# Altium schematic sheet filter.SchDoc
size A4
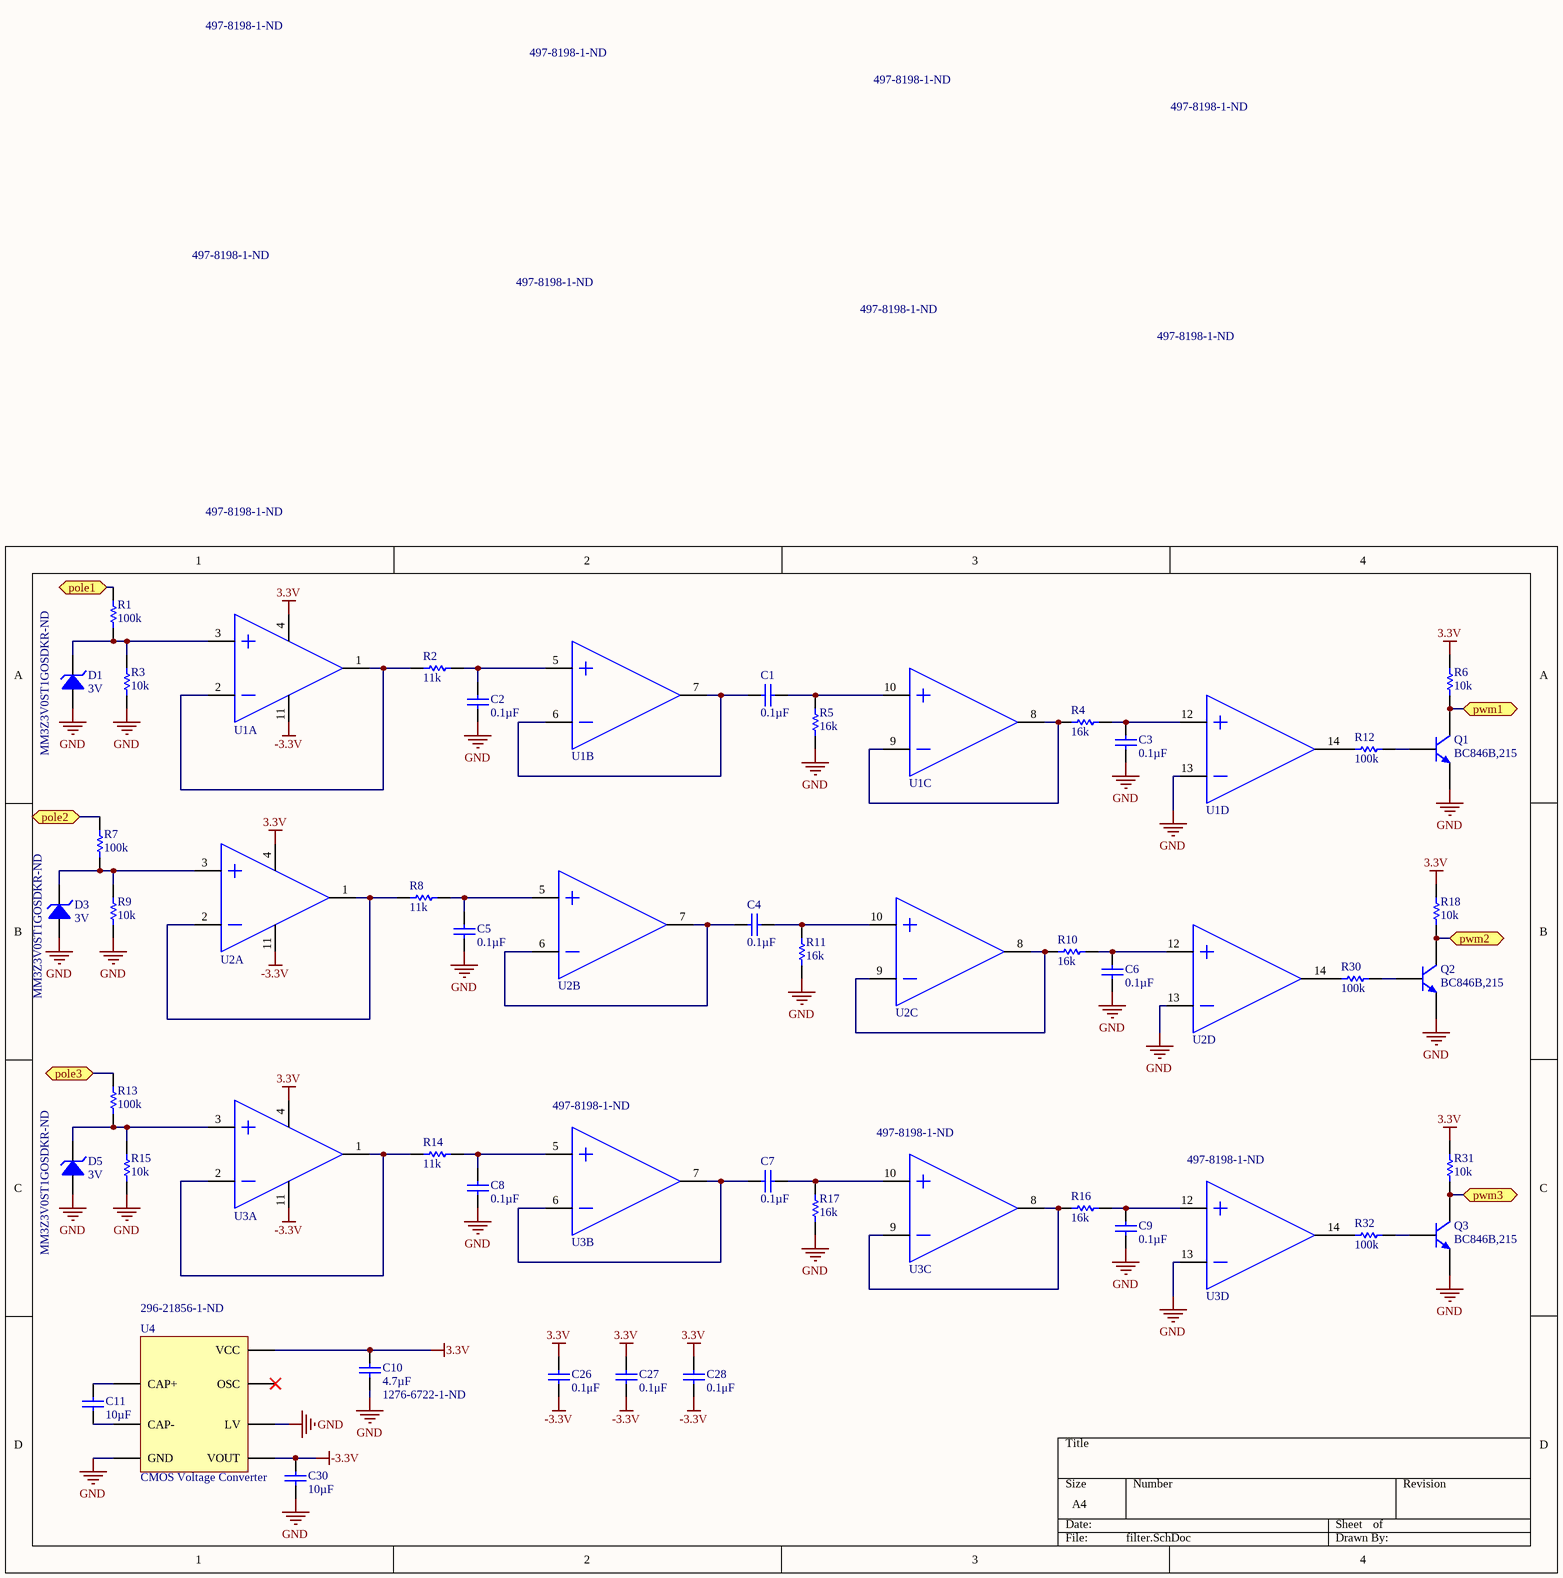
[diagram p0: filter.SchDoc]

## Parts
C1  Capacitance: 0.1µF  [CAPC1608N(0603")]  (hidden comment: 0.1uF, 50V, 10%, X7R, 1608)
C2  Capacitance: 0.1µF  [CAPC1608N(0603")]  (hidden comment: 0.1uF, 50V, 10%, X7R, 1608)
C3  Capacitance: 0.1µF  [CAPC1608N(0603")]  (hidden comment: 0.1uF, 50V, 10%, X7R, 1608)
C4  Capacitance: 0.1µF  [CAPC1608N(0603")]  (hidden comment: 0.1uF, 50V, 10%, X7R, 1608)
C5  Capacitance: 0.1µF  [CAPC1608N(0603")]  (hidden comment: 0.1uF, 50V, 10%, X7R, 1608)
C6  Capacitance: 0.1µF  [CAPC1608N(0603")]  (hidden comment: 0.1uF, 50V, 10%, X7R, 1608)
C7  Capacitance: 0.1µF  [CAPC1608N(0603")]  (hidden comment: 0.1uF, 50V, 10%, X7R, 1608)
C8  Capacitance: 0.1µF  [CAPC1608N(0603")]  (hidden comment: 0.1uF, 50V, 10%, X7R, 1608)
C9  Capacitance: 0.1µF  [CAPC1608N(0603")]  (hidden comment: 0.1uF, 50V, 10%, X7R, 1608)
C10  4.7µF  Supplier Part Number 1: 1276-6722-1-ND  [CAPC2012N(0805")]
C11  10µF  [CAPC3216N(1206")]
C26  0.1μF  [CAPC1608N(0603")]
C27  0.1μF  [CAPC1608N(0603")]
C28  0.1μF  [CAPC1608N(0603")]
C30  10µF  [CAPC2012N(0805")]
D1  Voltage - Zener (Nom) (Vz): 3V  Supplier Part Number 1: MM3Z3V0ST1GOSDKR-ND  [SC-90]  (hidden comment: ZENER MM3Z3V0ST1G)
D3  Voltage - Zener (Nom) (Vz): 3V  Supplier Part Number 1: MM3Z3V0ST1GOSDKR-ND  [SC-90]  (hidden comment: ZENER MM3Z3V0ST1G)
D5  Voltage - Zener (Nom) (Vz): 3V  Supplier Part Number 1: MM3Z3V0ST1GOSDKR-ND  [SC-90]  (hidden comment: ZENER MM3Z3V0ST1G)
Q1  BC846B,215  [SOT-23]
Q2  BC846B,215  [SOT-23]
Q3  BC846B,215  [SOT-23]
R1  100k  [RESC1608N(0603")]
R2  11k  [RESC1608N(0603")]
R3  10k  [RESC1608N(0603")]
R4  16k  [RESC1608N(0603")]
R5  16k  [RESC1608N(0603")]
R6  10k  [RESC1608N(0603")]
R7  100k  [RESC1608N(0603")]
R8  11k  [RESC1608N(0603")]
R9  10k  [RESC1608N(0603")]
R10  16k  [RESC1608N(0603")]
R11  16k  [RESC1608N(0603")]
R12  100k  [RESC1608N(0603")]
R13  100k  [RESC1608N(0603")]
R14  11k  [RESC1608N(0603")]
R15  10k  [RESC1608N(0603")]
R16  16k  [RESC1608N(0603")]
R17  16k  [RESC1608N(0603")]
R18  10k  [RESC1608N(0603")]
R30  100k  [RESC1608N(0603")]
R31  10k  [RESC1608N(0603")]
R32  100k  [RESC1608N(0603")]
U1  Supplier Part Number 1: 497-8198-1-ND  [SOP-14]  (hidden comment: Quad Op Amp TSV324)  (parts A,B,C,D of 4)
U2  Supplier Part Number 1: 497-8198-1-ND  [SOP-14]  (hidden comment: Quad Op Amp TSV324)  (parts A,B,C,D of 4)
U3  Supplier Part Number 1: 497-8198-1-ND  [SOP-14]  (hidden comment: Quad Op Amp TSV324)  (parts A,B,C,D of 4)
U4  CMOS Voltage Converter  Supplier Part Number 1: 296-21856-1-ND  [8-SOIC]

## Ports
pole1, pole2, pole3, pwm1, pwm2, pwm3

## Nets
3.3V: C10.2(Cathode) C26.2(Cathode) C27.2(Cathode) C28.2(Cathode) R6.2 R18.2 R31.2 U1.4(Vcc+) U2.4(Vcc+) U3.4(Vcc+) U4.8(VCC)
-3.3V: C26.1(Anode) C27.1(Anode) C28.1(Anode) C30.2(Cathode) U1.11(Vcc-) U2.11(Vcc-) U3.11(Vcc-) U4.5(VOUT)
GND: C2.1(Anode) C3.1(Anode) C5.1(Anode) C6.1(Anode) C8.1(Anode) C9.1(Anode) C10.1(Anode) C30.1(Anode) D1.A(Anode) D3.A(Anode) D5.A(Anode) Q1.2(E) Q2.2(E) Q3.2(E) R3.1 R5.1 R9.1 R11.1 R15.1 R17.1 U1.13(Inverting_Input_3) U2.13(Inverting_Input_3) U3.13(Inverting_Input_3) U4.3(GND) U4.6(LV)
pole1: R1.2 ; port pole1
pole2: R7.2 ; port pole2
pole3: R13.2 ; port pole3
pwm1: Q1.3(C) R6.1 ; port pwm1
pwm2: Q2.3(C) R18.1 ; port pwm2
pwm3: Q3.3(C) R31.1 ; port pwm3
NetC1_1: C1.1(Anode) U1.6(Inverting_Input_2) U1.7(Output_2)
NetC1_2: C1.2(Cathode) R5.2 U1.10(Non-Inverting_Input_3)
NetC2_2: C2.2(Cathode) R2.2 U1.5(Non-Inverting_Input_2)
NetC3_2: C3.2(Cathode) R4.1 U1.12(Non-Inverting_Input_4)
NetC4_1: C4.1(Anode) U2.6(Inverting_Input_2) U2.7(Output_2)
NetC4_2: C4.2(Cathode) R11.2 U2.10(Non-Inverting_Input_3)
NetC5_2: C5.2(Cathode) R8.2 U2.5(Non-Inverting_Input_2)
NetC6_2: C6.2(Cathode) R10.1 U2.12(Non-Inverting_Input_4)
NetC7_1: C7.1(Anode) U3.6(Inverting_Input_2) U3.7(Output_2)
NetC7_2: C7.2(Cathode) R17.2 U3.10(Non-Inverting_Input_3)
NetC8_2: C8.2(Cathode) R14.2 U3.5(Non-Inverting_Input_2)
NetC9_2: C9.2(Cathode) R16.1 U3.12(Non-Inverting_Input_4)
NetC11_1: C11.1(Anode) U4.4(CAP-)
NetC11_2: C11.2(Cathode) U4.2(CAP+)
NetD1_K: D1.K(Cathode) R1.1 R3.2 U1.3(Non-Inverting_Input_1)
NetD3_K: D3.K(Cathode) R7.1 R9.2 U2.3(Non-Inverting_Input_1)
NetD5_K: D5.K(Cathode) R13.1 R15.2 U3.3(Non-Inverting_Input_1)
NetQ1_1: Q1.1(B) R12.2
NetQ2_1: Q2.1(B) R30.2
NetQ3_1: Q3.1(B) R32.2
NetR2_1: R2.1 U1.1(Output_1) U1.2(Inverting_Input_1)
NetR4_2: R4.2 U1.8(Output_3) U1.9(Inverting_Input_3)
NetR8_1: R8.1 U2.1(Output_1) U2.2(Inverting_Input_1)
NetR10_2: R10.2 U2.8(Output_3) U2.9(Inverting_Input_3)
NetR12_1: R12.1 U1.14(Output_4)
NetR14_1: R14.1 U3.1(Output_1) U3.2(Inverting_Input_1)
NetR16_2: R16.2 U3.8(Output_3) U3.9(Inverting_Input_3)
NetR30_1: R30.1 U2.14(Output_4)
NetR32_1: R32.1 U3.14(Output_4)

Not connected (* = marked no-connect by the designer): U4 7(OSC)*

## Library data of the parts
C1-C9 = 0.1uF, 50V, 10%, X7R, 1608: CAP CER 0.1UF 50V 10% X7R 1608 (0603); Manufacturer: Samsung Electro-Mechanics America, Inc; Manufacturer Part Number: CL10B104KB8SFNC; Supplier 1: Digi-Key; RoHS: RoHS Compliant; Category: Capacitors; Stock 1: 743572; Pricing 1: 1=0.12, 10=0.033, 25=0.0232, 100=0.0152, 500=0.01064, 1000=0.00829 (CAD); Packaging: Cut Tape (CT); Tolerance: ±10%; Voltage - Rated: 50V; Temperature Coefficient: X7R; Mounting Type: Surface Mount, MLCC; Operating Temperature: -55°C ~ 125°C; Applications: Boardflex Sensitive; Ratings: -; Package / Case: 0603 (1608 Metric); Size / Dimension: 0.063" L x 0.031" W (1.60mm x 0.80mm); Height - Seated (Max): -; Thickness (Max): 0.035" (0.90mm); Lead Spacing: -; Features: Soft Termination; Lead Style: -; ComponentLink1URL: http://www.samsungsem.com/servlet/FileDownload?type=spec&file=CL10B104KB8SFNC.pdf; ComponentLink1Description: http://www.samsungsem.com/servlet/FileDownload?type=spec&file=CL10B104KB8SFNC.pdf; Supplier Part Number 1: 1276-1936-1-ND
C10 = 4.7uF 35V 0805 SMD, Ceramic: Capacitor, Ceramic, 35V, +/- 10%, 0805 SMD, X5R; Made By: Andy Bates; Published: 16-11-12; Publisher: AUVic; PackageDescription: Chip Capacitor; Value: 4.7µF; Supplier 1: Digi-Key
C11 = 10uF 50V 1206 SMD, Ceramic: Capacitor, Ceramic, 50V, +/- 10%, 1206 SMD, X5R; Published: 14-06-01; Publisher: AUVic; PackageDescription: Chip Capacitor; Value: 10µF; Supplier 1: Digi-Key; Supplier Part Number 1: 1276-2876-1-ND
C26-C28 = 0.1uF 100V 0603 SMD, Ceramic: Capacitor, Ceramic, 100V, +/- 10%, 0603 SMD, X7R; MFG: TDK; MFG#: CGA3E3X7S2A104K080AB; Published: 16-04-26; Publisher: AUVic; PackageDescription: Chip Capacitor; Value: 0.1μF; Created By: Ashwin Sira; Supplier 1: Digi-Key; Supplier Part Number 1: 445-6938-1-ND
C30 = 10uF 10V 0805 SMD, Ceramic: Capacitor, Ceramic, 10V, +/- 10%, 0805 SMD, X5R; Made By: Andy Bates; Published: 14-06-23; Publisher: AUVic; PackageDescription: Chip Capacitor; Value: 10µF; Supplier 1: Digi-Key; Supplier Part Number 1: 490-4735-1-ND
D1 D3 D5 = ZENER MM3Z3V0ST1G: DIODE ZENER 11V 200MW ±5% SOD323; Power - Max: 300mW; Impedance (Max) (Zzt): 100 Ohm; Category: ON Semiconductor; Tolerance: ±5%; Mounting Type: Surface Mount; Supplier Device Package: SOD-323; Supplier 1: Digi-Key
Q1-Q3 = BC846B,215: NPN 65V 100mA 250mW; Published: 8-Jun-2000; LatestRevisionDate: 09-Sep-2016; DatasheetVersion: 1997; Publisher: Andy Bates; Supplier 1: Digi-Key; Supplier Part Number 1: 568-1632-1-ND
R1 R7 R12 R13 R30 R32 = 100kR, 1%, 1/10W, 0603 SMD: Made By: Andy Bates; Owned By: AUVic; Created On: 14-06-30; Last Edited: 14-06-30; Value: 100k; Supplier 1: Digi-Key; Supplier Part Number 1: 311-100KGRCT-ND
R2 R8 R14 = 11kR, 1%, 1/10W, 0603 SMD: Made By: Ashwin Sira; Owned By: AUVic; Created On: 16-01-07; Last Edited: 16-01-07; Value: 11k; Supplier 1: Digi-Key; Supplier Part Number 1: 311-11.0KHRCT-ND
R3 R6 R9 R15 R18 R31 = 10kR, 1%, 1/10W, 0603 SMD: Made By: Ashwin Sira; Owned By: AUVic; Created On: 14-05-31; Last Edited: 14-05-31; Supplier 1: Digi-Key; Supplier Part Number 1: 311-10.0KHRCT-ND; Value: 10k
R4 R5 R10 R11 R16 R17 = 16kR, 1%, 1/10W, 0603 SMD: Made By: Ashwin Sira; Owned By: AUVic; Created On: 14-05-31; Last Edited: 14-05-31; Supplier 1: Digi-Key; Value: 16k; Supplier Part Number 1: 311-16.0KHRCT-ND
U1-U3 = Quad Op Amp TSV324: TSV324; LatestRevisionNote: Re-released for DXP Platform.; Publisher: Altium Limited; Created By: Jordan; Creation Date: 10/14/2016; Supplier: Digikey; Supplier Part Number: 497-8198-2-ND; Supplier 1: Digi-Key
U4 = TL7660: LatestRevisionDate: 17-Jul-2002; LatestRevisionNote: Re-released for DXP Platform.; Publisher: Altium Limited; Created By: Jordan; Manufacturer Part No.: TL7660; Supplier 1: Digi-Key